# EAGLE design ESP12_TEMP (EAGLE 9.5.2)
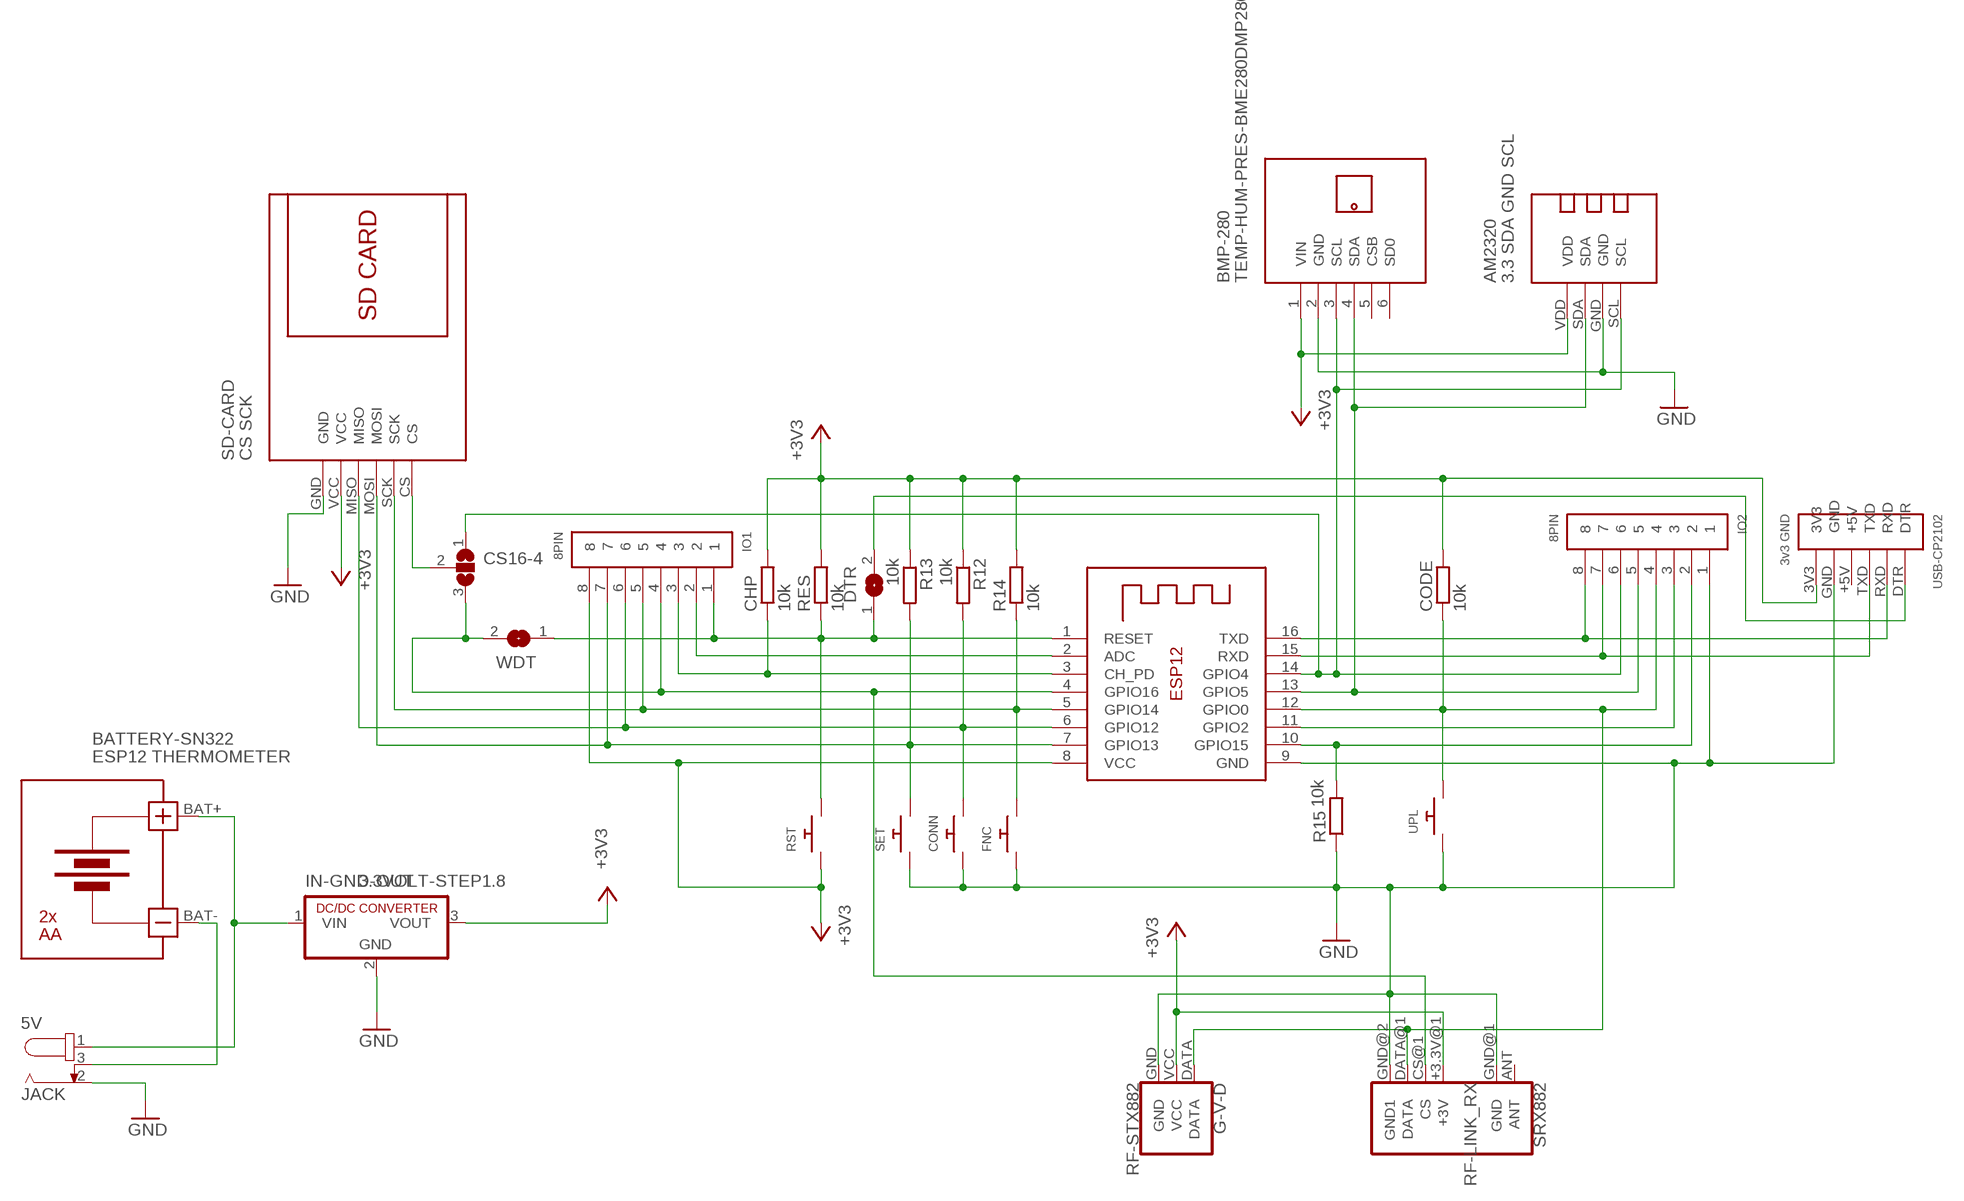
[diagram p0: schematic, sheet 1]

## Parts
5V  JACK  [JACK]
AM2320  3.3 SDA GND SCL  TEMP-HUM-SENSOR-AM2320AM2320S  [TEMP-HUM-SENSOR-AM2322S]
BATTERY-SN322  ESP12 THERMOMETER  BATTERY-HOLDER-2AA  [BATTERY-HOLDER-2AA]
BMP-280  TEMP-HUM-PRES-BME280DMP280S  [TEMP-HUM-PRES-BME280S]
CHP  10k  R-5MM0204/5  [0204/5]
CODE  10k  R-5MM0204/5  [0204/5]
CONN  SWITCH_PUSHBUTTONEVQ-PE  [TACT_PANA-EVQ]
CS16-4  JUMERS3-SMD  [SJ_2]
DTR  JUMPER-SMD  [SJ]
ESP12E  ESP-12  [ESP-12]
FNC  SWITCH_PUSHBUTTONEVQ-PE  [TACT_PANA-EVQ]
G-V-D  RF-STX882  RF-LINK_TX  [RF-LINK_TX]
IN-GND-OUT  3.3VOLT-STEP1.8  [SIP3]
IO1  8PIN  [8PIN]
IO2  8PIN  [8PIN]
R12  10k  R-5MM0204/5  [0204/5]
R13  10k  R-5MM0204/5  [0204/5]
R14  10k  R-5MM0204/5  [0204/5]
R15  10k  R-5MM0204/5  [0204/5]
RES  10k  R-5MM0204/5  [0204/5]
RST  SWITCH_PUSHBUTTONEVQ-PE  [TACT_PANA-EVQ]
SD-CARD  CS SCK  CARD-SD-ADAPTERSD-CARD  [CARD-SD-ADAPTERS]
SET  SWITCH_PUSHBUTTONEVQ-PE  [TACT_PANA-EVQ]
SRX882  RF-LINK_RX  [RF-LINK_RX]
UPL  SWITCH_PUSHBUTTONEVQ-PE  [TACT_PANA-EVQ]
USB-CP2102  3v3 GND  USB-UART  [USB-UART]
WDT  JUMPER-SMD  [SJ]

## Nets
+3V3 [supply]: AM2320.VDD BMP-280.1(VIN) CHP.2 CODE.2 ESP12E.8(VCC) G-V-D.VCC IN-GND-OUT.3(VOUT) IO1.8 R12.1 R13.1 R14.2 RES.2 RST.P$1 SD-CARD.VCC SRX882.+3.3V@1(+3V) USB-CP2102.3V3
BAT$1 [battery-gnd]: 5V.1 BATTERY-SN322.BAT+ IN-GND-OUT.1(VIN)
BAT$2 [battery-gnd]: 5V.3 BATTERY-SN322.BAT-
GND [battery-gnd]: 5V.2 AM2320.GND BMP-280.2(GND) CONN.P$1 ESP12E.9(GND) FNC.P$1 G-V-D.GND IN-GND-OUT.2(GND) IO2.1 R15.1 SD-CARD.GND SET.P$1 SRX882.GND@1(GND) SRX882.GND@2(GND1) UPL.P$1 USB-CP2102.GND
N$3: DTR.2 USB-CP2102.DTR
N$4: DTR.1 ESP12E.1(RESET) IO1.1 RES.1 RST.P$2 WDT.1
N$5: ESP12E.2(ADC) IO1.2
N$6: CHP.1 ESP12E.3(CH_PD) IO1.3
N$7: CS16-4.3 ESP12E.4(GPIO16) IO1.4 SRX882.CS@1(CS) WDT.2
N$8: ESP12E.5(GPIO14) FNC.P$2 IO1.5 R14.1 SD-CARD.SCK
N$9: CONN.P$2 ESP12E.6(GPIO12) IO1.6 R12.2 SD-CARD.MISO
N$10: ESP12E.7(GPIO13) IO1.7 R13.2 SD-CARD.MOSI SET.P$2
N$11: CS16-4.2 SD-CARD.CS
N$12: ESP12E.16(TXD) IO2.8 USB-CP2102.RXD
N$13: ESP12E.15(RXD) IO2.7 USB-CP2102.TXD
N$14: AM2320.SCL BMP-280.3(SCL) CS16-4.1 ESP12E.14(GPIO4) IO2.6
N$16: CODE.1 ESP12E.12(GPIO0) G-V-D.DATA IO2.4 SRX882.DATA@1(DATA) UPL.P$2
N$17: ESP12E.11(GPIO2) IO2.3
N$18: ESP12E.10(GPIO15) IO2.2 R15.2
N$19: AM2320.SDA BMP-280.4(SDA) ESP12E.13(GPIO5) IO2.5
Unconnected: BMP-280.5(CSB) BMP-280.6(SD0) SRX882.ANT

## Power pins joined to a net without a drawn wire
+5V: USB-CP2102.+5V

## Library data of the parts
5V = Ipfcz:JACK: CONN PWR JACK 1.05X3.5MM SOLDER Manufacturer's datasheet <https://katalog.we-online.de/em/datasheet/6941xx303002.pdf>; CREATED_BY: PCBLayout.com; DIGIKEY_PART_NUMBER: 732-5925-ND; MANUFACTURER: Wurth Electronics Inc.; MPN: 694103303002
AM2320 = Ipfcz:TEMP-HUM-SENSOR-AM2320: AM2322 - digital humidity & temperature sensor More information about AM2322 is available here: http://www.electrodragon.com/w/AM2322 Click here to find device on ebay.com <http://www.ebay.com/sch/am2322+digital+sensor>
BATTERY-SN322 = Ipfcz:BATTERY-HOLDER-2AA: Battery Holder 2 x AA Click here to find device on ebay.com <http://www.ebay.com/sch/battery+plastic+holder+aa+2x1.5v>
BMP-280 = Ipfcz:TEMP-HUM-PRES-BME280: Digital Humidity-Temperature-Pressure Sensor based on BME280 device More information about BME280 device is available here: https://www.bosch-sensortec.com/bst/products/all_products/bme280 Click here to find device on ebay.com <http://www.ebay.com/sch/bme280+breakout>
CHP CODE R12-R15 RES = Ipfcz:R-5MM: RESISTOR, European symbol; SPICEPREFIX: R
CONN FNC RST SET UPL = Ipfcz:SWITCH_PUSHBUTTON: Buttons SOFTTOUCHSMD_SJ - Soft touch temporary push button (Super Junk Akihabara) Compatible with SKPMANE010 [Mouser: 688-SKPMAN] C&K_KSS = Digikey: KSS221GLFS
CS16-4 = Ipfcz:JUMERS3-SMD: SMD solder JUMPER
DTR WDT = Ipfcz:JUMPER-SMD: SMD solder JUMPER
ESP12E = Ipfcz:ESP-12
G-V-D = Ipfcz:RF-LINK_TX: RF Link Transmitter (434 MHz, 315 MHz) These wireless transmitters work with equivalent receivers. They can easily fit into a breadboard and work well with microcontrollers to create a very simple wireless data link. Since these are only transmitters, they will only work communicating data one-way, you would need two pairs (of different frequencies) to act as a transmitter/receiver pair. SparkFun Products RF Link Transmitter - 434MHz <https://www.sparkfun.com/products/10534> (WRL-10534); SF_ID: WRL-10534
IN-GND-OUT = Ipfcz:3.3VOLT-STEP: INNOLINE DC/DC-Converter 1.0 AMP SIP3 Single Output Source: Data sheet <http://www.mikrocontroller.net/attachment/150645/157764-da-01-en-DC_DC_WANDLER_R_78C5_0_1_0.pdf>
IO1 IO2 = Ipfcz:8PIN: CONN HEADER VERT 8POS 2.54MM Manufacturer's datasheet <https://katalog.we-online.de/em/datasheet/6130xx11121.pdf>; CREATED_BY: PCBLayout.com; DIGI_KEY_PART_NUMBER: 732-5321-ND; MANUFACTURER: Wurth Electronics Inc.; MPN: 61300811121
SD-CARD = Ipfcz:CARD-SD-ADAPTER: Full Size SD Card Adapter Module with onboard 3.3V regulator Guide describing how to use SD card with Arduino is available here: https://www.arduino.cc/en/Reference/SDCardNotes Click here to find device on ebay.com <http://www.ebay.com/sch/sd+card+socket+module>
SRX882 = Ipfcz:RF-LINK_RX: RF Link Receiver (434 MHz, 315 MHz) These wireless receivers work with equivalent transmitters. They can easily fit into a breadboard and work well with microcontrollers to create a very simple wireless data link. Since these are only receivers, they will only work communicating data one-way, you would need two pairs (of different frequencies) to act as a transmitter/receiver pair..https://arduino-shop.cz/arduino/3172-nicerf-433mhz-vysilac-prijimac-antena-set-3ks.html?gclid=Cj0KCQiApt_xBRDxARIsAAMUMu9ytbPAJVJoCFmnPErxJJjcUJUaiy6aU1-Ntjcd1giAIkBWV9RzoL0aAiFDEALw_wcB SparkFun Products RF Link Receiver - 4800bps (434 MHz) <https://www.sparkfun.com/products/10532>(WRL-10532); SF_ID: WRL-10533
USB-CP2102 = Ipfcz:USB-UART: CONN HEADER VERT 6POS 2.54MM Manufacturer's datasheet <https://katalog.we-online.de/em/datasheet/6130xx11121.pdf>; CREATED_BY: PCBLayout.com; DIGI_KEY_PART_NUMBER: 732-5319-ND; MANUFACTURER: Wurth Electronics Inc.; MPN: 61300611121

## Net classes
0 default: width 0.406 mm
1 battery-gnd: width 1.143 mm
2 supply: width 0.635 mm

## Board
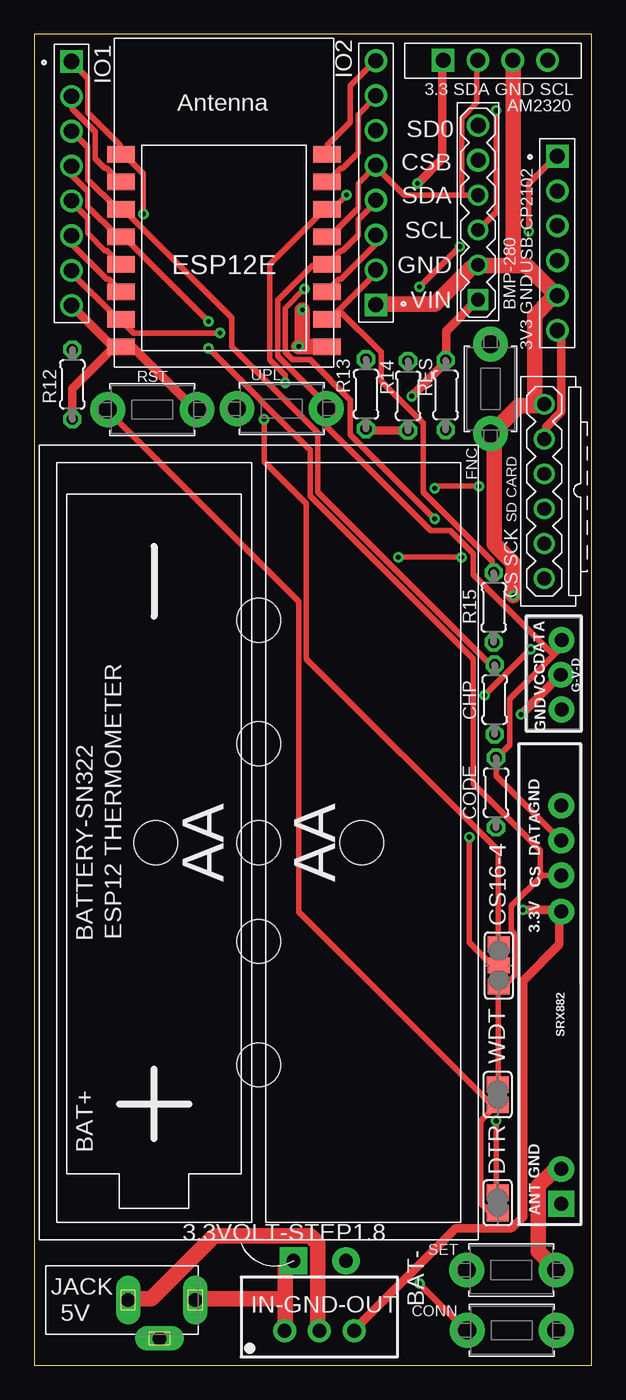
[diagram p1: board, top side]
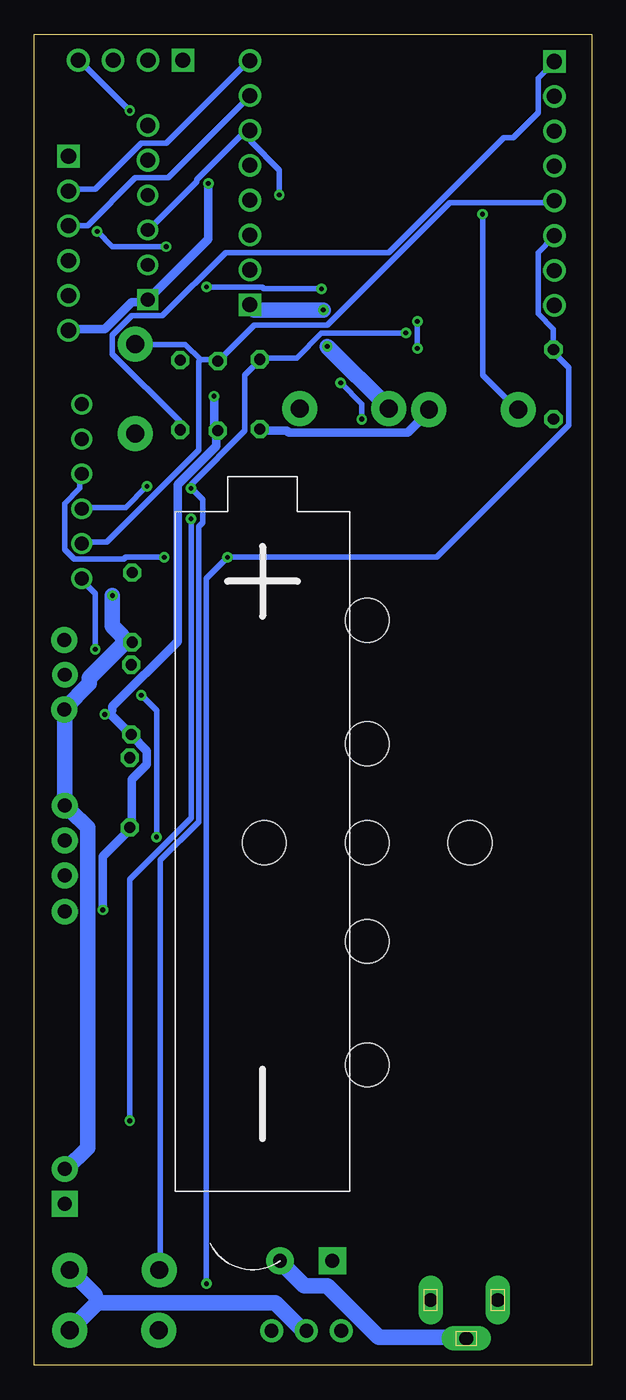
[diagram p2: board, bottom side, seen from below]

Size 40.6 x 97 mm. Coordinates in mm from the lower left corner, seen from the top.
Outline: 0,0 40.6,0 40.6,97 0,97 0,0
Copper layers (1*16): Top 0.035mm / dielectric 1.5mm / Bottom 0.035mm
Design rules "default": minimum track width 6mil, minimum drill 0.35mm, track to track 6mil, track to pad 6mil, pad to pad 6mil, via to via 6mil, smd to smd 6mil, copper to edge 40mil, drill to drill 6mil, minimum pad ring 10mil, minimum via ring 8mil, stop-mask expansion 4mil, vias tented up to drill 0mil, thermal gap 10mil

### Footprints (pad centres in the part's own frame; a part is rotated, then mirrored left to right if it is on the bottom)
JACK = drill 1 pad 1.8 long: 1 0,0; 2 -4.9,0; 3 -2.6,-2.8
TEMP-HUM-SENSOR-AM2322S = drill 1.1: GND 1.22,-0.1; SCL 3.76,-0.1; SDA -1.32,-0.1 | drill 1.1 square: VDD -3.86,-0.1
BATTERY-HOLDER-2AA = drill 1 pad 2 square: BAT+ -30.48,-2.54 | drill 1 pad 2: BAT- -30.48,-6.35 | hole 3.2: 0,7.5; 0,-7.5; 0,0; -7.2,0; 7.2,0; -16.2,0; 16.2,0
TEMP-HUM-PRES-BME280S = drill 1 square: 1 -5.08,3.81 | drill 1: 2 -5.08,1.27; 3 -5.08,-1.27; 4 -5.08,-3.81 | drill 1.1: 5 -5.08,-6.35; 6 -5.08,-8.89
0204/5 = drill 0.813 octagon: 1 -2.54,0; 2 2.54,0
TACT_PANA-EVQ = drill 1.3 pad 2.54: P$1 -3.25,0; P$2 3.25,0
SJ_2 = smd 1.168 x 1.6: 1 -1.524,0; 2 0,0; 3 1.524,0
SJ = smd 1.168 x 1.6: 1 -0.762,0; 2 0.762,0
ESP-12 = smd 2 x 1.2: 1 -7.5,4.5; 2 -7.5,2.5; 3 -7.5,0.5; 4 -7.5,-1.5; 5 -7.5,-3.5; 6 -7.5,-5.5; 7 -7.5,-7.5; 8 -7.5,-9.5; 9 7.5,-9.5; 10 7.5,-7.5; 11 7.5,-5.5; 12 7.5,-3.5; 13 7.5,-1.5; 14 7.5,0.5; 15 7.5,2.5; 16 7.5,4.5
RF-LINK_TX = drill 1.016 pad 1.88: DATA -1.27,0.673; GND 3.81,0.673; VCC 1.27,0.627
SIP3 = drill 1 pad 1.676: 1 -2.54,0; 2 0,0; 3 2.54,0
8PIN = drill 1.1 square: 1 -8.89,0 | drill 1.1: 2 -6.35,0; 3 -3.81,0; 4 -1.27,0; 5 1.27,0; 6 3.81,0; 7 6.35,0; 8 8.89,0
CARD-SD-ADAPTERS = drill 1: CS -1.27,-5.08; GND -1.27,7.62; MISO -1.27,2.54; MOSI -1.27,0; SCK -1.27,-2.54; VCC -1.27,5.08
RF-LINK_RX = drill 1.016 pad 1.88: +3.3V@1 5.7,-1.17; CS@1 8.34,-1.17; DATA@1 10.88,-1.17; GND@1 -13.06,-1.17; GND@2 13.42,-1.17 | drill 1.016 pad 1.88 square: ANT -15.6,-1.17
USB-UART = drill 1.1: 3V3 6.35,0; +5V 1.27,0; GND 3.81,0; RXD -3.81,0; TXD -1.27,0 | drill 1.1 square: DTR -6.35,0

### Placement (x,y rotation side)
5V  11.73,4.75 0 top
AM2320  33.64,95.21 0 top
BATTERY-SN322  16.35,38.09 90 top
BMP-280  27.25,81.47 180 top
CHP  33.54,48.51 270 top
CODE  33.64,41.73 270 top
CONN  34.78,2.54 180 top
CS16-4  33.84,29.13 270 top
DTR  33.76,11.84 90 top
ESP12E  13.81,83.73 0 top
FNC  33.24,71.16 90 top
G-V-D  37.74,51.59 270 top
IN-GND-OUT  20.77,2.51 0 top
IO1  2.71,86.13 270 top
IO2  24.89,86.18 90 top
R12  2.77,71.49 90 top
R13  24.17,70.77 90 top
R14  27.23,70.65 270 top
R15  33.47,55.23 90 top
RES  29.97,70.71 90 top
RST  8.6,69.64 180 top
SD-CARD  38.42,62.42 0 top
SET  34.76,6.94 180 top
SRX882  37.22,27.36 90 top
UPL  18.02,69.71 0 top
USB-CP2102  38.11,81.77 270 top
WDT  33.76,19.72 90 top

### Tracks (layer width: path | path; a pad name or v marks a point on that pad's centre or on a via)
+3V3  (via drill 0.35)
  Top 0.635: IN-GND-OUT.3 23.31,2.59 30.71,9.99 34.77,9.99 35.6,10.83 35.6,28.01 38.26,30.67 38.26,33.04 SRX882.+3.3V@1 37.98,33.18 v35.6,33.18 | SD-CARD.VCC 37.28,67.55 37.28,68.39 38.4,69.5 38.4,75.09 38.12,75.37 USB-CP2102.3V3 | BMP-280.1 32.25,77.61 30.02,75.37 30.02,73.28 RES.2 29.88,73 v27.5,70.62 | v27.92,86.13 29.74,87.94 29.74,95.07 AM2320.VDD | v35.46,47.43 38.26,50.23 G-V-D.VCC | ESP12E.8 6.27,74.25 5.71,74.25 2.77,77.19 IO1.8 | R12.1 2.77,69.08 2.77,71.18 5.57,73.97 ESP12E.8 | R14.2 24.29,68.11 R13.1 | ESP12E.8 6.55,74.11 7.25,74.11 11.72,69.64 RST.P$1
  Bottom 0.635: v27.92,86.13 27.92,82.08 32.25,77.75 BMP-280.1 32.53,77.47 33.51,77.47 35.46,75.51 37.98,75.51 USB-CP2102.3V3 | 35.05,47.43 v35.46,47.43 | 35.05,47.43 33.79,46.17 CHP.2 33.51,45.9 32.39,44.78 32.39,43.8 33.51,42.68 33.51,39.33 CODE.2 33.79,38.91 35.6,37.09 v35.6,33.18 | R13.1 24.15,68.11 22.19,68.11 22.05,67.97 13.39,67.97 11.86,69.5 RST.P$1 | 35.05,47.43 34.91,47.71 34.91,47.99 30.16,52.74 30.16,64.2 27.36,66.99 27.36,68.11 R14.2 27.5,68.39 v27.5,70.62
BAT$1
  Top 1.143: 18.28,4.82 18.28,6.92 18.84,7.48 BATTERY-SN322.BAT+ | 18.28,4.82 18.28,2.59 IN-GND-OUT.1 | 18.28,4.82 11.86,4.82 5V.1
BAT$2
  Bottom 1.143: 5V.3 9.2,2.03 15.49,2.03 19.26,5.8 20.94,5.8 22.61,7.48 BATTERY-SN322.BAT-
GND  (via drill 0.35)
  Top 1.143: v19.26,74.25 19.54,74.25 | 19.54,74.25 21.21,74.25 ESP12E.9 | 36.44,69.92 35.32,69.92 33.37,67.97 FNC.P$1 33.51,67.41 33.51,59.87 34.91,58.47 v34.91,56.09 | 36.44,69.92 37.14,69.92 SD-CARD.GND | 34.91,80.12 35.88,80.12 37.98,78.03 USB-CP2102.GND 37.56,77.61 36.44,76.49 36.44,69.92 | 34.91,80.12 32.39,80.12 BMP-280.2 31.83,79.98 29.18,77.33 24.99,77.33 IO2.1 | 34.91,80.12 34.91,95.07 AM2320.GND | v19.54,76.91 19.54,74.25 | SRX882.GND@1 38.26,14.18 37.84,14.18 36.72,13.07 36.72,8.32 37.98,7.06 SET.P$1 | 5V.2 6.97,4.82 8.5,4.82 13.11,9.43 20.1,9.43 20.66,8.87 20.66,2.59 IN-GND-OUT.2
  Bottom 1.143: v19.26,74.25 14.79,69.78 UPL.P$1 | v19.54,76.91 24.57,76.91 24.85,77.19 IO2.1 | 34.07,52.6 33.51,52.6 R15.1 | 34.07,52.6 36.58,50.09 36.58,49.67 38.4,47.85 G-V-D.GND 38.4,47.29 38.4,40.87 SRX882.GND@2 37.98,40.45 36.72,39.19 36.72,15.86 38.26,14.32 SRX882.GND@1 | 36.02,4.54 23.03,4.54 21.08,2.59 20.8,2.59 IN-GND-OUT.2 | 36.02,4.54 37.98,2.59 CONN.P$1 | SET.P$1 37.98,6.92 36.16,5.1 36.02,4.54 | v34.91,56.09 34.91,53.86 34.21,53.16 34.07,52.6
N$3  (via drill 0.35)
  Top 0.406: v33.65,17.82 33.65,12.65 DTR.2 | v29.18,61.68 23.03,67.83 23.03,70.34 20.1,73.28 18.84,73.28 18.28,73.83 18.28,77.05 v19.68,78.44 | v30.99,81.52 v28.06,78.58 | v36.02,82.64 36.02,86.13 37.98,88.08 USB-CP2102.DTR
  Bottom 0.406: v33.65,17.82 33.65,35.42 29.18,39.89 v29.18,61.68 | v19.68,78.44 23.87,78.44 24.01,78.58 v28.06,78.58 | v30.99,81.52 34.91,81.52 v36.02,82.64
N$4  (via drill 0.35)
  Top 0.406: IO1.1 2.77,94.93 3.89,93.81 3.89,91.3 6.27,88.92 6.27,88.36 ESP12E.1 6.41,88.08 6.69,88.08 7.94,86.83 v7.94,83.89 | DTR.1 33.65,11.11 33.23,11.11 32.53,11.81 32.53,17.82 33.65,18.93 WDT.1 33.37,18.93 19.26,33.04 19.26,55.67 5.43,69.5 RST.P$2
  Bottom 0.406: RES.1 30.02,68.25 30.02,68.81 34.91,73.69 34.91,75.09 33.51,76.49 31.27,76.49 26.66,81.1 14.79,81.1 6.41,89.48 5.71,89.48 3.89,91.3 3.89,93.81 2.77,94.93 IO1.1 | v7.94,83.89 7.94,72.16 5.43,69.64 RST.P$2
N$5
  Top 0.406: ESP12E.2 6.27,86.27 5.29,87.25 5.15,87.25 4.45,87.94 4.45,89.9 2.77,91.58 2.77,92.42 IO1.2
N$6
  Top 0.406: IO1.3 2.77,89.9 3.89,88.78 3.89,86.41 5.99,84.31 6.27,84.31 ESP12E.3 6.41,84.31 14.37,76.35 14.37,74.25 20.66,67.97 20.66,63.64 33.23,51.06 33.51,51.06 CHP.1
N$7  (via drill 0.35)
  Top 0.406: IO1.4 2.77,87.39 2.77,86.69 3.89,85.57 3.89,84.45 5.99,82.36 6.27,82.36 ESP12E.4 6.41,82.08 6.69,82.08 v12.69,76.07 | WDT.2 33.79,20.61 33.79,27.59 CS16-4.3 33.93,27.73 34.35,27.73 35.05,28.43 35.05,31.37 34.77,31.65 34.77,33.46 37,35.7 | 37,35.7 38.26,35.7 SRX882.CS@1 | v12.69,74.11 20.1,66.71 20.1,63.36 31.97,51.48 31.97,42.4 36.86,37.51 36.86,35.84 37,35.7
  Bottom 0.406: v12.69,74.11 v12.69,76.07
N$8
  Top 0.406: ESP12E.5 6.27,80.26 5.29,81.24 5.15,81.24 3.89,82.5 3.89,83.61 2.77,84.73 IO1.5
  Bottom 0.406: 28.48,73.28 27.36,73.28 R14.1 27.08,73.28 24.57,75.79 19.26,75.79 10.32,84.73 2.77,84.73 IO1.5 | 28.48,73.28 29.6,74.39 33.23,74.39 FNC.P$2 | SD-CARD.SCK 37.14,60.01 35.32,60.01 28.62,66.71 28.62,73.14 28.48,73.28
N$9  (via drill 0.35)
  Top 0.406: ESP12E.6 6.27,78.31 5.43,79.14 5.29,79.14 2.77,81.66 2.77,82.22 IO1.6 | v26.52,58.89 v31.13,58.89 | v28.06,5.94 31.41,2.59 CONN.P$2
  Bottom 0.406: IO1.6 2.77,82.22 3.89,81.1 3.89,76.63 2.77,75.51 2.77,74.11 R12.2 2.77,73.83 1.66,72.72 1.66,68.53 11.3,58.89 v26.52,58.89 28.06,57.35 v28.06,5.94 | v31.13,58.89 33.93,58.89 34.07,58.75 37.7,58.75 38.4,59.45 38.4,62.8 37.28,63.92 37.28,64.89 SD-CARD.MISO
N$10  (via drill 0.35)
  Top 0.406: IO1.7 2.63,79.7 5.99,76.35 6.27,76.35 ESP12E.7 6.41,76.07 7.25,75.23 v13.53,75.23 | v32.39,64.06 29.32,64.06 v29.18,63.92
  Bottom 0.406: v13.53,75.23 19.68,75.23 21.49,73.42 24.15,73.42 R13.2 24.29,73.14 25.27,72.16 25.27,68.11 29.18,64.2 v29.18,63.92 28.34,63.08 28.34,61.4 28.62,61.12 28.62,39.61 31.41,36.81 31.41,7.06 SET.P$2 | v32.39,64.06 33.93,62.52 37.14,62.52 SD-CARD.MOSI
N$11  (via drill 0.35)
  Top 0.406: v31.69,38.49 31.69,30.81 33.37,29.13 33.79,29.13 CS16-4.2 | v36.16,52.18 v32.81,48.83
  Bottom 0.406: v31.69,38.49 31.69,47.71 v32.81,48.83 | v36.16,52.18 36.16,56.23 37.14,57.21 SD-CARD.CS
N$12
  Top 0.406: ESP12E.16 21.35,88.36 21.35,88.92 23.03,90.6 23.03,93.25 24.85,95.07 IO2.8
  Bottom 0.406: USB-CP2102.RXD 37.98,85.71 36.16,85.71 32.81,89.06 30.99,89.06 24.99,95.07 IO2.8
N$13
  Top 0.406: ESP12E.15 21.35,86.27 22.33,87.25 22.47,87.25 23.59,88.36 23.59,91.16 24.85,92.42 IO2.7
  Bottom 0.406: USB-CP2102.TXD 37.98,83.06 36.72,83.06 33.23,86.55 30.85,86.55 24.99,92.42 IO2.7
N$14  (via drill 0.35)
  Top 0.406: v33.65,91.44 33.65,84.03 32.39,82.78 BMP-280.3 | v16.74,68.94 16.74,65.87 19.82,62.8 19.82,51.48 33.79,37.51 33.79,30.67 CS16-4.1 | v18.28,71.6 18.28,72.16 17.16,73.28 17.16,80.26 21.21,84.31 ESP12E.14 21.49,84.31 21.77,84.31 v22.75,85.29
  Bottom 0.406: BMP-280.3 32.25,82.78 28.76,86.27 28.76,86.41 25.27,89.9 24.99,89.9 IO2.6 24.85,89.76 24.85,89.2 22.75,87.11 v22.75,85.29 | v33.65,91.44 37.28,95.07 AM2320.SCL | v16.74,68.94 16.74,70.06 v18.28,71.6
N$16
  Top 0.406: SRX882.DATA@1 38.26,38.35 33.65,42.96 33.65,44.22 CODE.1 33.79,44.36 34.63,45.2 34.63,48.55 37.84,51.76 | 37.84,51.76 38.4,52.32 38.4,52.74 G-V-D.DATA | IO2.4 24.99,84.87 23.59,83.47 23.59,82.36 22.47,81.24 22.33,81.24 21.35,80.26 ESP12E.12 21.21,80.12 20.24,80.12 17.72,77.61 17.72,73.56 21.21,70.06 21.21,69.78 UPL.P$2 21.35,69.64 21.35,68.39 28.9,60.84 30.3,60.84 31.97,59.17 31.97,57.63 37.84,51.76
N$17
  Top 0.406: ESP12E.11 21.35,78.31 22.19,79.14 22.33,79.14 24.85,81.66 24.85,82.36 IO2.3
N$18
  Top 0.406: 22.19,76.91 24.99,79.7 IO2.2 | 22.19,76.91 21.63,76.35 21.35,76.35 ESP12E.10 | 22.19,76.91 25.27,73.83 25.27,71.74 28.34,68.67 28.34,63.64 33.37,58.61 33.37,57.91 R15.2
N$19
  Top 0.406: ESP12E.13 21.35,82.36 21.63,82.36 23.59,84.31 23.59,86.13 24.85,87.39 IO2.5 24.99,87.25 26.94,85.29 31.13,85.29 | 31.13,85.29 32.25,85.29 BMP-280.4 | 31.13,85.29 31.13,90.88 32.25,92 32.25,95.07 AM2320.SDA

### Text on the board
tNames: 3V3 GND